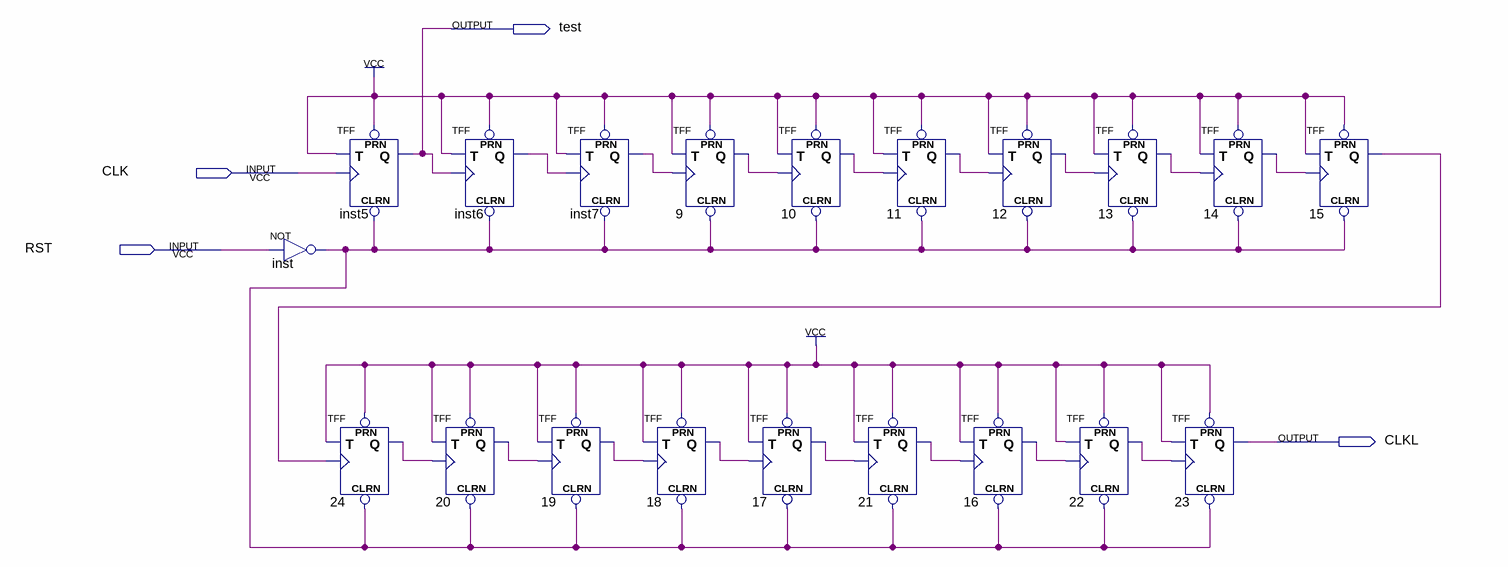
[diagram p0: schematic sheet]
// Quartus schematic clock.bdf as structural Verilog: 20 symbols, 4 pins
module clock (
  input  CLK,
  input  RST,
  output test,
  output CLKL
);

  wire inst6_q, inst7_q, inst_out, n9_q, n10_q, n11_q, n12_q, n13_q, n14_q, n15_q, n16_q, n17_q, n18_q,
       n19_q, n20_q, n21_q, n22_q, n24_q;

  not inst (inst_out, RST);
  TFF inst5 (.PRN(1'b1), .CLRN(inst_out), .T(1'b1), .CLK(CLK), .Q(test));
  TFF u_24 (.PRN(1'b1), .CLRN(inst_out), .T(1'b1), .CLK(n15_q), .Q(n24_q));
  TFF u_20 (.PRN(1'b1), .CLRN(inst_out), .T(1'b1), .CLK(n24_q), .Q(n20_q));
  TFF inst6 (.PRN(1'b1), .CLRN(inst_out), .T(1'b1), .CLK(test), .Q(inst6_q));
  TFF inst7 (.PRN(1'b1), .CLRN(inst_out), .T(1'b1), .CLK(inst6_q), .Q(inst7_q));
  TFF u_19 (.PRN(1'b1), .CLRN(inst_out), .T(1'b1), .CLK(n20_q), .Q(n19_q));
  TFF u_9 (.PRN(1'b1), .CLRN(inst_out), .T(1'b1), .CLK(inst7_q), .Q(n9_q));
  TFF u_18 (.PRN(1'b1), .CLRN(inst_out), .T(1'b1), .CLK(n19_q), .Q(n18_q));
  TFF u_17 (.PRN(1'b1), .CLRN(inst_out), .T(1'b1), .CLK(n18_q), .Q(n17_q));
  TFF u_10 (.PRN(1'b1), .CLRN(inst_out), .T(1'b1), .CLK(n9_q), .Q(n10_q));
  TFF u_11 (.PRN(1'b1), .CLRN(inst_out), .T(1'b1), .CLK(n10_q), .Q(n11_q));
  TFF u_21 (.PRN(1'b1), .CLRN(inst_out), .T(1'b1), .CLK(n17_q), .Q(n21_q));
  TFF u_16 (.PRN(1'b1), .CLRN(inst_out), .T(1'b1), .CLK(n21_q), .Q(n16_q));
  TFF u_12 (.PRN(1'b1), .CLRN(inst_out), .T(1'b1), .CLK(n11_q), .Q(n12_q));
  TFF u_13 (.PRN(1'b1), .CLRN(inst_out), .T(1'b1), .CLK(n12_q), .Q(n13_q));
  TFF u_22 (.PRN(1'b1), .CLRN(inst_out), .T(1'b1), .CLK(n16_q), .Q(n22_q));
  TFF u_14 (.PRN(1'b1), .CLRN(inst_out), .T(1'b1), .CLK(n13_q), .Q(n14_q));
  TFF u_23 (.PRN(1'b1), .CLRN(inst_out), .T(1'b1), .CLK(n22_q), .Q(CLKL));
  TFF u_15 (.PRN(1'b1), .CLRN(inst_out), .T(1'b1), .CLK(n14_q), .Q(n15_q));
endmodule
